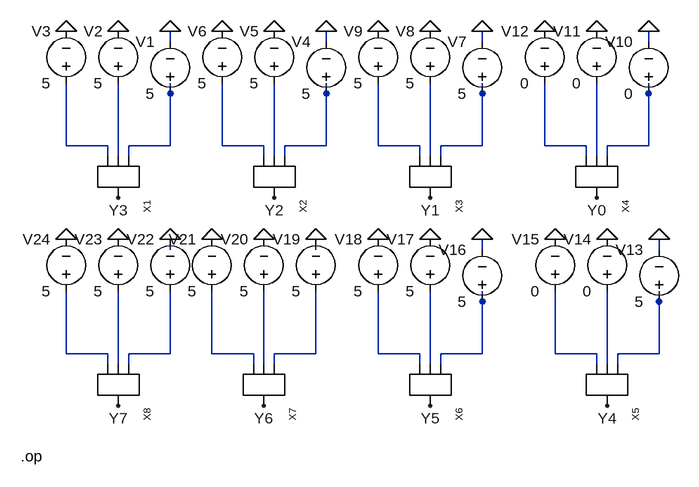
[diagram p0: schematic 8bit(OR).asc]
8bit(OR).asc, the LTspice schematic file:
Version 4
SHEET 1 880 680
WIRE -224 -288 -224 -304
WIRE 16 -288 16 -304
WIRE 256 -288 256 -304
WIRE 512 -288 512 -304
WIRE -224 -208 -224 -224
WIRE 16 -208 16 -224
WIRE 256 -208 256 -224
WIRE 512 -208 512 -224
WIRE -384 -128 -384 -224
WIRE -320 -128 -384 -128
WIRE -224 -128 -224 -208
WIRE -224 -128 -288 -128
WIRE -144 -128 -144 -224
WIRE -80 -128 -144 -128
WIRE 16 -128 16 -208
WIRE 16 -128 -48 -128
WIRE 96 -128 96 -224
WIRE 160 -128 96 -128
WIRE 256 -128 256 -208
WIRE 256 -128 192 -128
WIRE 352 -128 352 -224
WIRE 416 -128 352 -128
WIRE 512 -128 512 -208
WIRE 512 -128 448 -128
WIRE -320 -112 -320 -128
WIRE -304 -112 -304 -224
WIRE -288 -112 -288 -128
WIRE -80 -112 -80 -128
WIRE -64 -112 -64 -224
WIRE -48 -112 -48 -128
WIRE 160 -112 160 -128
WIRE 176 -112 176 -224
WIRE 192 -112 192 -128
WIRE 416 -112 416 -128
WIRE 432 -112 432 -224
WIRE 448 -112 448 -128
WIRE -224 32 -224 16
WIRE 0 32 0 16
WIRE 256 32 256 16
WIRE 528 32 528 16
WIRE 256 112 256 96
WIRE 528 112 528 96
WIRE -384 192 -384 96
WIRE -320 192 -384 192
WIRE -224 192 -224 96
WIRE -224 192 -288 192
WIRE -160 192 -160 96
WIRE -96 192 -160 192
WIRE 0 192 0 96
WIRE 0 192 -64 192
WIRE 96 192 96 96
WIRE 160 192 96 192
WIRE 256 192 256 112
WIRE 256 192 192 192
WIRE 368 192 368 96
WIRE 432 192 368 192
WIRE 528 192 528 112
WIRE 528 192 464 192
WIRE -320 208 -320 192
WIRE -304 208 -304 96
WIRE -288 208 -288 192
WIRE -96 208 -96 192
WIRE -80 208 -80 96
WIRE -64 208 -64 192
WIRE 160 208 160 192
WIRE 176 208 176 96
WIRE 192 208 192 192
WIRE 432 208 432 192
WIRE 448 208 448 96
WIRE 464 208 464 192
FLAG -224 -304 0
FLAG -304 -304 0
FLAG -384 -304 0
FLAG 16 -304 0
FLAG -64 -304 0
FLAG -144 -304 0
FLAG 256 -304 0
FLAG 176 -304 0
FLAG 96 -304 0
FLAG 512 -304 0
FLAG 432 -304 0
FLAG 352 -304 0
FLAG 528 16 0
FLAG 448 16 0
FLAG 368 16 0
FLAG 256 16 0
FLAG 176 16 0
FLAG 96 16 0
FLAG 0 16 0
FLAG -80 16 0
FLAG -160 16 0
FLAG -224 16 0
FLAG -304 16 0
FLAG -384 16 0
FLAG 432 -48 Y0
FLAG 176 -48 Y1
FLAG -64 -48 Y2
FLAG -304 -48 Y3
FLAG -304 272 Y7
FLAG -80 272 Y6
FLAG 176 272 Y5
FLAG 448 272 Y4
SYMBOL OR -320 16 R90
SYMATTR InstName X1
SYMBOL voltage -224 -192 R180
WINDOW 0 24 96 Left 2
WINDOW 3 24 16 Left 2
SYMATTR InstName V1
SYMATTR Value 5
SYMBOL voltage -304 -208 R180
WINDOW 0 24 96 Left 2
WINDOW 3 24 16 Left 2
SYMATTR InstName V2
SYMATTR Value 5
SYMBOL voltage -384 -208 R180
WINDOW 0 24 96 Left 2
WINDOW 3 24 16 Left 2
SYMATTR InstName V3
SYMATTR Value 5
SYMBOL OR -80 16 R90
SYMATTR InstName X2
SYMBOL voltage 16 -192 R180
WINDOW 0 24 96 Left 2
WINDOW 3 24 16 Left 2
SYMATTR InstName V4
SYMATTR Value 5
SYMBOL voltage -64 -208 R180
WINDOW 0 24 96 Left 2
WINDOW 3 24 16 Left 2
SYMATTR InstName V5
SYMATTR Value 5
SYMBOL voltage -144 -208 R180
WINDOW 0 24 96 Left 2
WINDOW 3 24 16 Left 2
SYMATTR InstName V6
SYMATTR Value 5
SYMBOL OR 160 16 R90
SYMATTR InstName X3
SYMBOL voltage 256 -192 R180
WINDOW 0 24 96 Left 2
WINDOW 3 24 16 Left 2
SYMATTR InstName V7
SYMATTR Value 5
SYMBOL voltage 176 -208 R180
WINDOW 0 24 96 Left 2
WINDOW 3 24 16 Left 2
SYMATTR InstName V8
SYMATTR Value 5
SYMBOL voltage 96 -208 R180
WINDOW 0 24 96 Left 2
WINDOW 3 24 16 Left 2
SYMATTR InstName V9
SYMATTR Value 5
SYMBOL OR 416 16 R90
SYMATTR InstName X4
SYMBOL voltage 512 -192 R180
WINDOW 0 24 96 Left 2
WINDOW 3 24 16 Left 2
SYMATTR InstName V10
SYMATTR Value 0
SYMBOL voltage 432 -208 R180
WINDOW 0 24 96 Left 2
WINDOW 3 24 16 Left 2
SYMATTR InstName V11
SYMATTR Value 0
SYMBOL voltage 352 -208 R180
WINDOW 0 24 96 Left 2
WINDOW 3 24 16 Left 2
SYMATTR InstName V12
SYMATTR Value 0
SYMBOL OR 432 336 R90
SYMATTR InstName X5
SYMBOL voltage 528 128 R180
WINDOW 0 24 96 Left 2
WINDOW 3 24 16 Left 2
SYMATTR InstName V13
SYMATTR Value 5
SYMBOL voltage 448 112 R180
WINDOW 0 24 96 Left 2
WINDOW 3 24 16 Left 2
SYMATTR InstName V14
SYMATTR Value 0
SYMBOL voltage 368 112 R180
WINDOW 0 24 96 Left 2
WINDOW 3 24 16 Left 2
SYMATTR InstName V15
SYMATTR Value 0
SYMBOL OR 160 336 R90
SYMATTR InstName X6
SYMBOL voltage 256 128 R180
WINDOW 0 24 96 Left 2
WINDOW 3 24 16 Left 2
SYMATTR InstName V16
SYMATTR Value 5
SYMBOL voltage 176 112 R180
WINDOW 0 24 96 Left 2
WINDOW 3 24 16 Left 2
SYMATTR InstName V17
SYMATTR Value 5
SYMBOL voltage 96 112 R180
WINDOW 0 24 96 Left 2
WINDOW 3 24 16 Left 2
SYMATTR InstName V18
SYMATTR Value 5
SYMBOL OR -96 336 R90
SYMATTR InstName X7
SYMBOL voltage 0 112 R180
WINDOW 0 24 96 Left 2
WINDOW 3 24 16 Left 2
SYMATTR InstName V19
SYMATTR Value 5
SYMBOL voltage -80 112 R180
WINDOW 0 24 96 Left 2
WINDOW 3 24 16 Left 2
SYMATTR InstName V20
SYMATTR Value 5
SYMBOL voltage -160 112 R180
WINDOW 0 24 96 Left 2
WINDOW 3 24 16 Left 2
SYMATTR InstName V21
SYMATTR Value 5
SYMBOL OR -320 336 R90
SYMATTR InstName X8
SYMBOL voltage -224 112 R180
WINDOW 0 24 96 Left 2
WINDOW 3 24 16 Left 2
SYMATTR InstName V22
SYMATTR Value 5
SYMBOL voltage -304 112 R180
WINDOW 0 24 96 Left 2
WINDOW 3 24 16 Left 2
SYMATTR InstName V23
SYMATTR Value 5
SYMBOL voltage -384 112 R180
WINDOW 0 24 96 Left 2
WINDOW 3 24 16 Left 2
SYMATTR InstName V24
SYMATTR Value 5
TEXT -454 350 Left 2 !.op

The netlist it stands for:
* 8bit(OR).asc
XX1 N001 N009 N005 Y3 OR  ; pins A B C Y
V1 N001 0 5
V2 N009 0 5
V3 N005 0 5
XX2 N002 N010 N006 Y2 OR  ; pins A B C Y
V4 N002 0 5
V5 N010 0 5
V6 N006 0 5
XX3 N003 N011 N007 Y1 OR  ; pins A B C Y
V7 N003 0 5
V8 N011 0 5
V9 N007 0 5
XX4 N004 N012 N008 Y0 OR  ; pins A B C Y
V10 N004 0 0
V11 N012 0 0
V12 N008 0 0
XX5 N014 N024 N020 Y4 OR  ; pins A B C Y
V13 N014 0 5
V14 N024 0 0
V15 N020 0 0
XX6 N013 N023 N019 Y5 OR  ; pins A B C Y
V16 N013 0 5
V17 N023 0 5
V18 N019 0 5
XX7 N018 N022 N017 Y6 OR  ; pins A B C Y
V19 N018 0 5
V20 N022 0 5
V21 N017 0 5
XX8 N016 N021 N015 Y7 OR  ; pins A B C Y
V22 N016 0 5
V23 N021 0 5
V24 N015 0 5
.op
.backanno
.end